# EAGLE design EPWR01 (EAGLE 7.2.0)
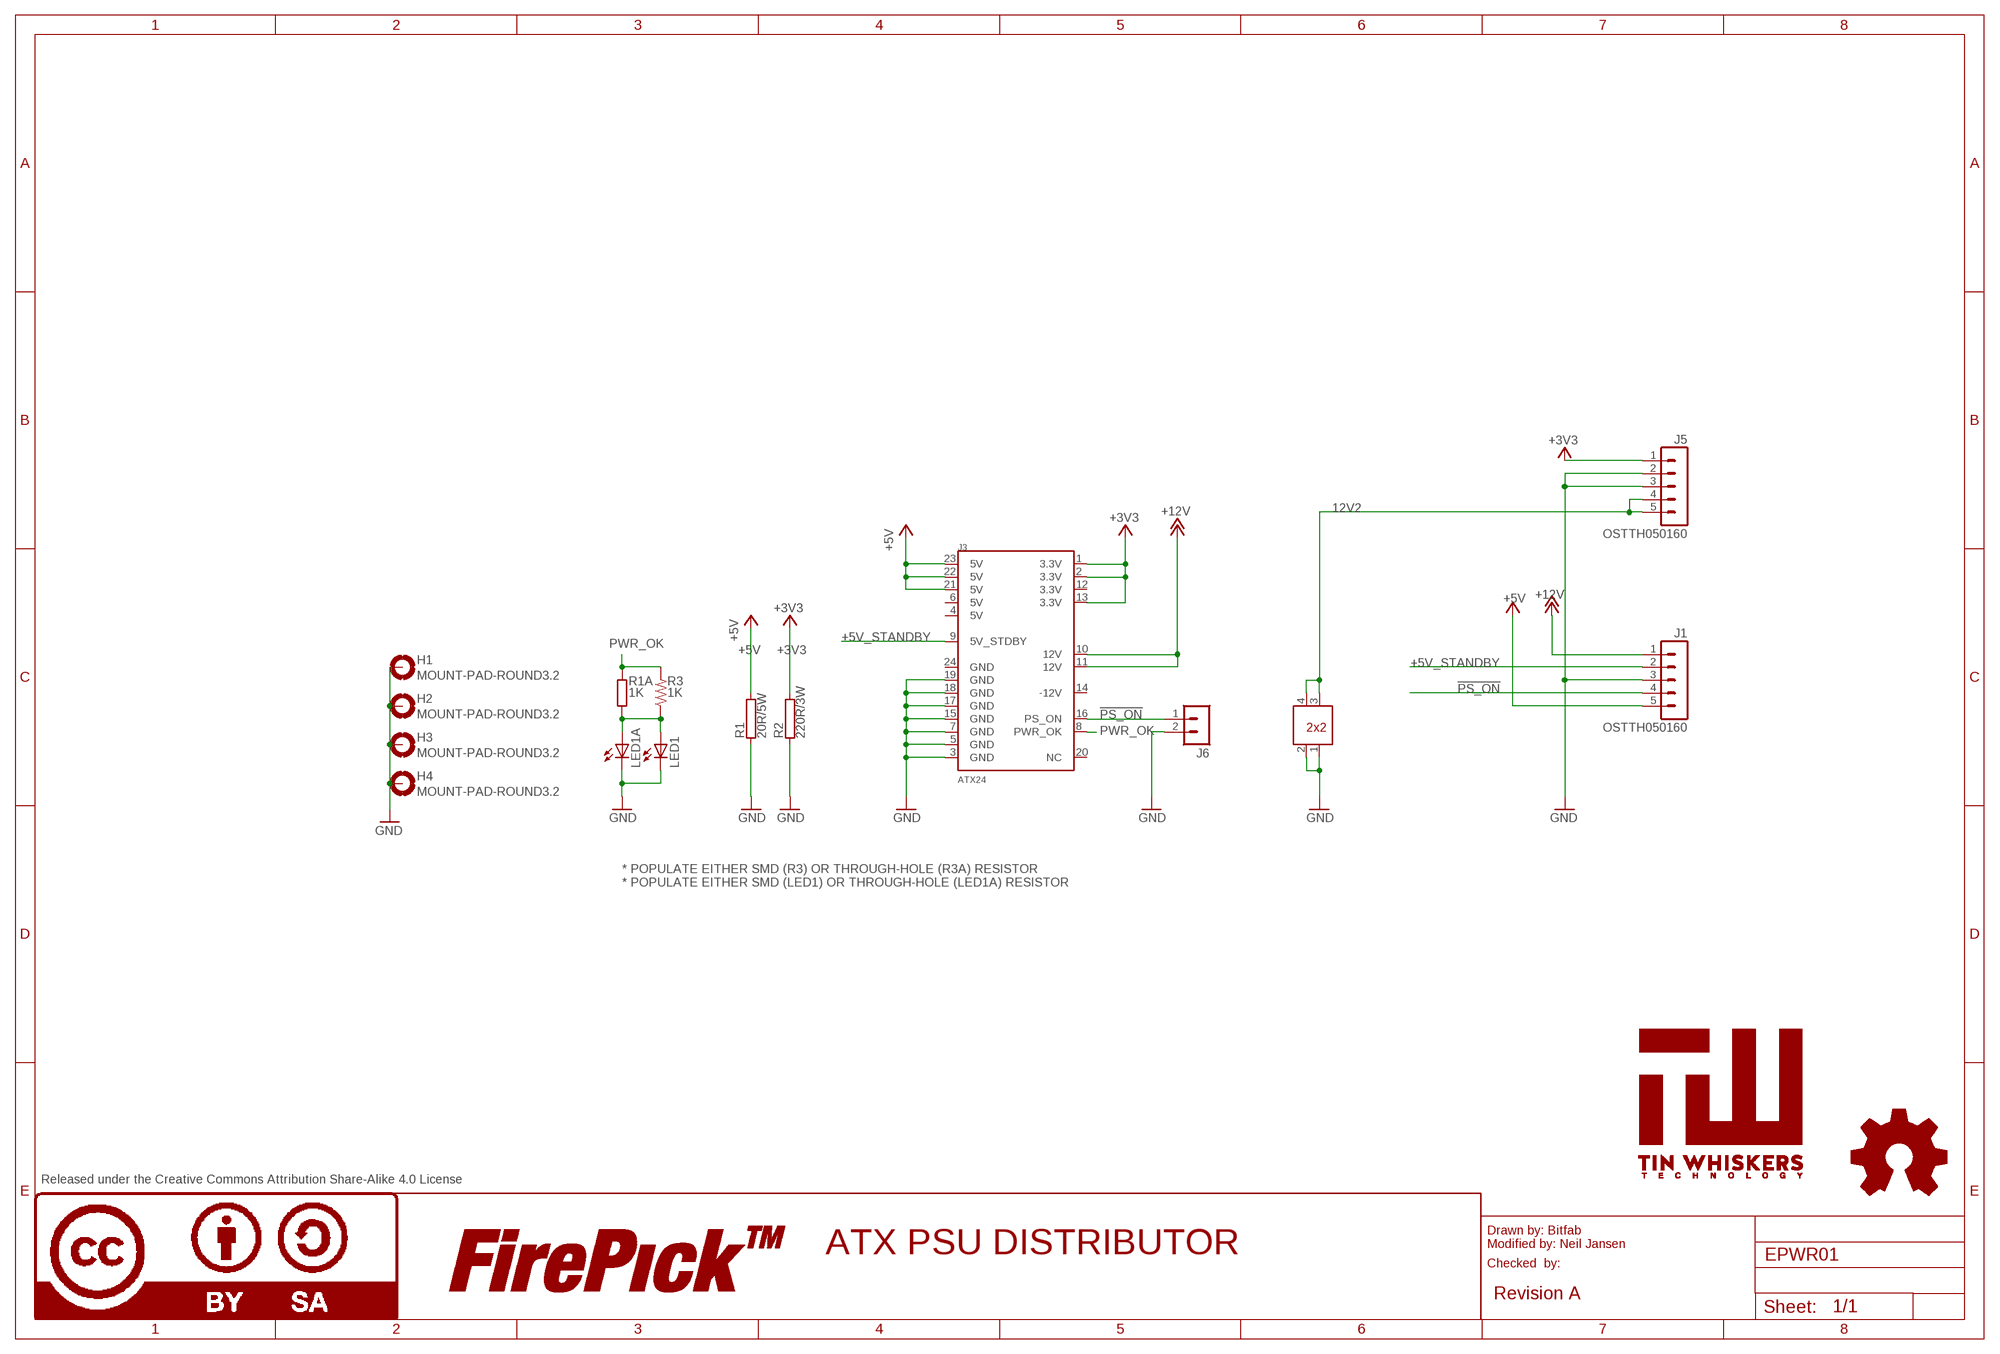
[diagram p0: schematic, sheet 1]

## Parts
H1  MOUNT-PAD-ROUND3.2  [3,2-PAD]
H2  MOUNT-PAD-ROUND3.2  [3,2-PAD]
H3  MOUNT-PAD-ROUND3.2  [3,2-PAD]
H4  MOUNT-PAD-ROUND3.2  [3,2-PAD]
J1  OSTTH050160  CONN-OSTTH050160  [CONN-OSTTH050160]
J3  ATX24  ATX24-REVERSIBLE  [ATX24]
J4  ATX2X2  [ATX2X2]
J5  OSTTH050160  CONN-OSTTH050160  [CONN-OSTTH050160]
J6  MA02-1  [MA02-1]
LED1  LED1206  [LED-1206]
LED1A  LED3MM  [LED3MM]
LOGO4  LOGO-FIREPICKLARGE  [LOGO-FIREPICK]
LOGO5  LOGO-OSHWMEDIUM  [LOGO-OSHW-MEDIUM]
LOGO6  LOGO-CC-BY-SALARGE  [LOGO-CC-BY-SA]
R1  20R/5W  RHPS923  [HPS923]
R1A  1K  R-EU_0207/10  [0207/10]
R2  220R/3W  RCA4050  [CA4050]
R3  1K  RESISTOR0805-RES  [0805]
U$1  TIN-WHISKERSSMALL  [TIN-WHISKERS-SMALL]

## Nets
12V2: J4.3 J4.4 J5.4 J5.5
!PS_ON: J1.4 J3.16(PS_ON) J6.1
+3V3: J3.1(3.3V) J3.2(3.3V) J3.13(3.3V) J5.1 R2.2
+5V: J1.5 J3.21(5V) J3.22(5V) J3.23(5V) R1.2
+5V_STANDBY: J1.2 J3.9(5V_STDBY)
+12V: J1.1 J3.10(12V) J3.11(12V)
GND: H1.B3,2(MOUNT) H2.B3,2(MOUNT) H3.B3,2(MOUNT) H4.B3,2(MOUNT) J1.3 J3.3(GND) J3.5(GND) J3.7(GND) J3.15(GND) J3.17(GND) J3.18(GND) J3.19(GND) J4.1 J4.2 J5.2 J5.3 J6.2 LED1.C LED1A.K(C) R1.1 R2.1
N$2: LED1.A LED1A.A R1A.1 R3.1
PWR_OK: J3.8(PWR_OK) R1A.2 R3.2
Unconnected: J3.4(5V) J3.6(5V) J3.12(3.3V) J3.14(-12V) J3.20(NC) J3.24(GND)

## Notes on the sheet
- * POPULATE EITHER SMD (R3) OR THROUGH-HOLE (R3A) RESISTOR
  * POPULATE EITHER SMD (LED1) OR THROUGH-HOLE (LED1A) RESISTOR
- Released under the Creative Commons Attribution Share-Alike 4.0 License
- Drawn by: Bitfab
  Modified by: Neil Jansen
- Checked  by:
- ATX PSU DISTRIBUTOR
- Revision A

## Library data of the parts
H1-H4 = holes:MOUNT-PAD-ROUND: MOUNTING PAD, round; BOM: EXCLUDE
J1 J5 = FirePick:CONN-OSTTH050160; PARTNO: OSTTH050160
J3 = SparkFun:ATX24-REVERSIBLE; PARTNO: 2-1586043-4
J4 = SparkFun:ATX2X2; PARTNO: 1586041-4
J6 = !con-lstb:MA02-1; PARTNO: CONN-0.1-RA-1X2
LED1 = SparkFun-LED:LED: LEDs Standard schematic elements and footprints for 5mm, 3mm, 1206, and 0603 sized LEDs. 5mm - Spark Fun Electronics SKU : COM-00529 (and others); PARTNO: LTST-C150AKT
LED1A = led:LED: LED OSRAM: - CHIPLED LG R971, LG N971, LY N971, LG Q971, LY Q971, LO R971, LY R971 LH N974, LH R974 LS Q976, LO Q976, LY Q976 LO Q996 - Hyper CHIPLED LW Q18S LB Q993, LB Q99A, LB R99A - SideLED LS A670, LO A670, LY A670, LG A670, LP A670 LB A673, LV A673, LT A673, LW A673 LH A674 LY A675 LS A676, LA A676, LO A676, LY A676, LW A676 LS A679, LY A679, LG A679 - Hyper Micro SIDELED® LS Y876, LA Y876, LO Y876, LY Y876 LT Y87S - SmartLED LW L88C, LW L88S LB L89C, LB L89S, LG L890 LS L89K, LO L89K, LY L89K LS L896, LA L896, LO L896, LY L896 - TOPLED LS T670, LO T670, LY T670, LG T670, LP T670 LSG T670, LSP T670, LSY T670, LOP T670, LYG T670 LG T671, LOG T671, LSG T671 LB T673, LV T673, LT T673, LW T673 LH T674 LS T676, LA T676, LO T676, LY T676, LB T676, LH T676, LSB T676, LW T676 LB T67C, LV T67C, LT T67C, LS T67K, LO T67K, LY T67K, LW E67C LS E67B, LA E67B, LO E67B, LY E67B, LB E67C, LV E67C, LT E67C LW T67C LS T679, LY T679, LG T679 LS T770, LO T770, LY T770, LG T770, LP T770 LB T773, LV T773, LT T773, LW T773 LH T774 LS E675, LA E675, LY E675, LS T675 LS T776, LA T776, LO T776, LY T776, LB T776 LHGB T686 LT T68C, LB T68C - Hyper Mini TOPLED® LB M676 - Mini TOPLED Santana® LG M470 LS M47K, LO M47K, LY M47K Source: http://www.osram.convergy.de LUXEON: - LUMILED® LXK2-PW12-R00, LXK2-PW12-S00, LXK2-PW14-U00, LXK2-PW14-V00 LXK2-PM12-R00, LXK2-PM12-S00, LXK2-PM14-U00 LXK2-PE12-Q00, LXK2-PE12-R00, LXK2-PE12-S00, LXK2-PE14-T00, LXK2-PE14-U00 LXK2-PB12-K00, LXK2-PB12-L00, LXK2-PB12-M00, LXK2-PB14-N00, LXK2-PB14-P00, LXK2-PB14-Q00 LXK2-PR12-L00, LXK2-PR12-M00, LXK2-PR14-Q00, LXK2-PR14-R00 LXK2-PD12-Q00, LXK2-PD12-R00, LXK2-PD12-S00 LXK2-PH12-R00, LXK2-PH12-S00 LXK2-PL12-P00, LXK2-PL12-Q00, LXK2-PL12-R00 Source: www.luxeon.com KINGBRIGHT: KA-3528ASYC Source: www.kingbright.com; DNP: T; PARTNO: *
LOGO4 = FirePick:LOGO-FIREPICK; BOM: EXCLUDE
LOGO5 = FirePick:LOGO-OSHW; BOM: EXCLUDE
LOGO6 = FirePick:LOGO-CC-BY-SA; BOM: EXCLUDE
R1 = resistor-power:R: Power Resitor; OC_FARNELL: unknown; OC_NEWARK: unknown; PARTNO: SQP500JB-20R
R1A = resistor:R-EU_: RESISTOR, European symbol; DNP: T
R2 = resistor-power:R: Power Resitor; OC_FARNELL: unknown; OC_NEWARK: unknown; PARTNO: PNP3WVJR-73-220R
R3 = SparkFun-Resistors:RESISTOR: Resistor Basic schematic elements and footprints for 0603, 1206, and PTH resistors.; PARTNO: RC0805FR-071KL
U$1 = !tin-whiskers:TIN-WHISKERS

## Net classes
0 default: width 0.152 mm, drill 0.305 mm, clearance 0.152 mm

## Board
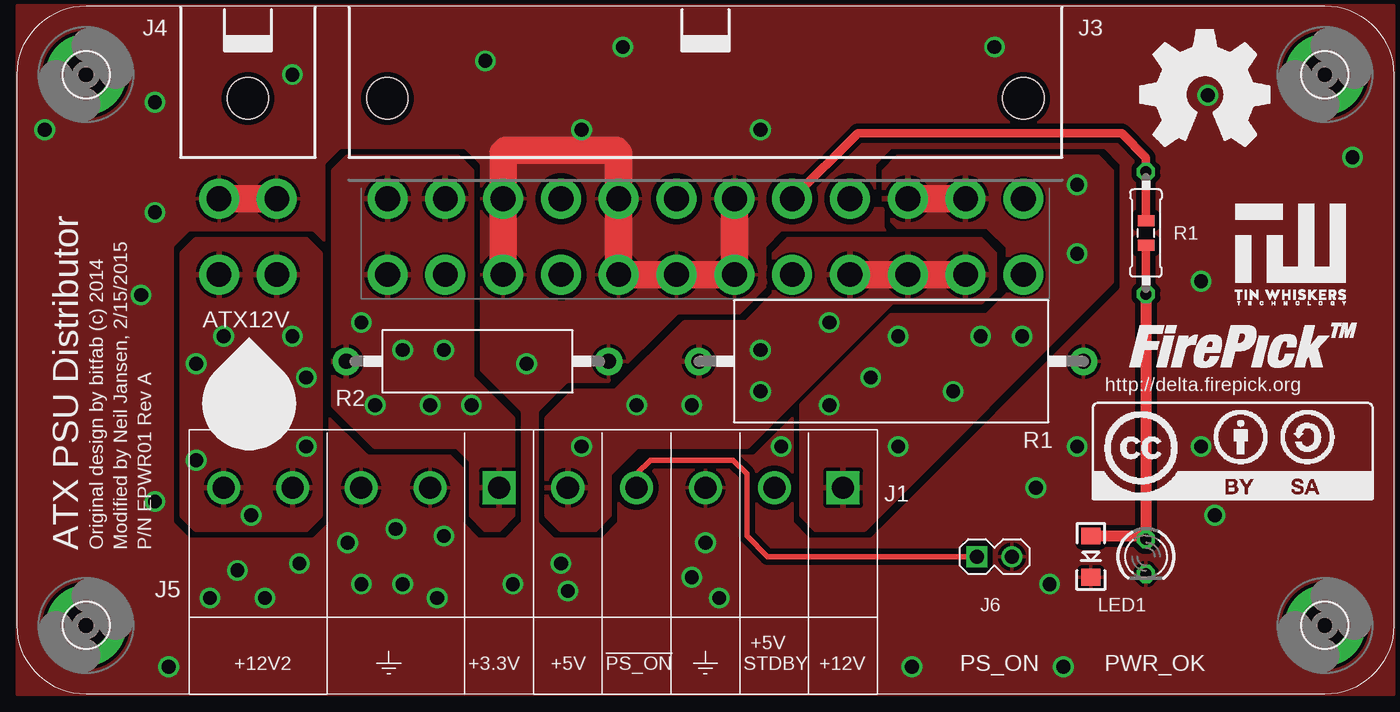
[diagram p1: board, top side]
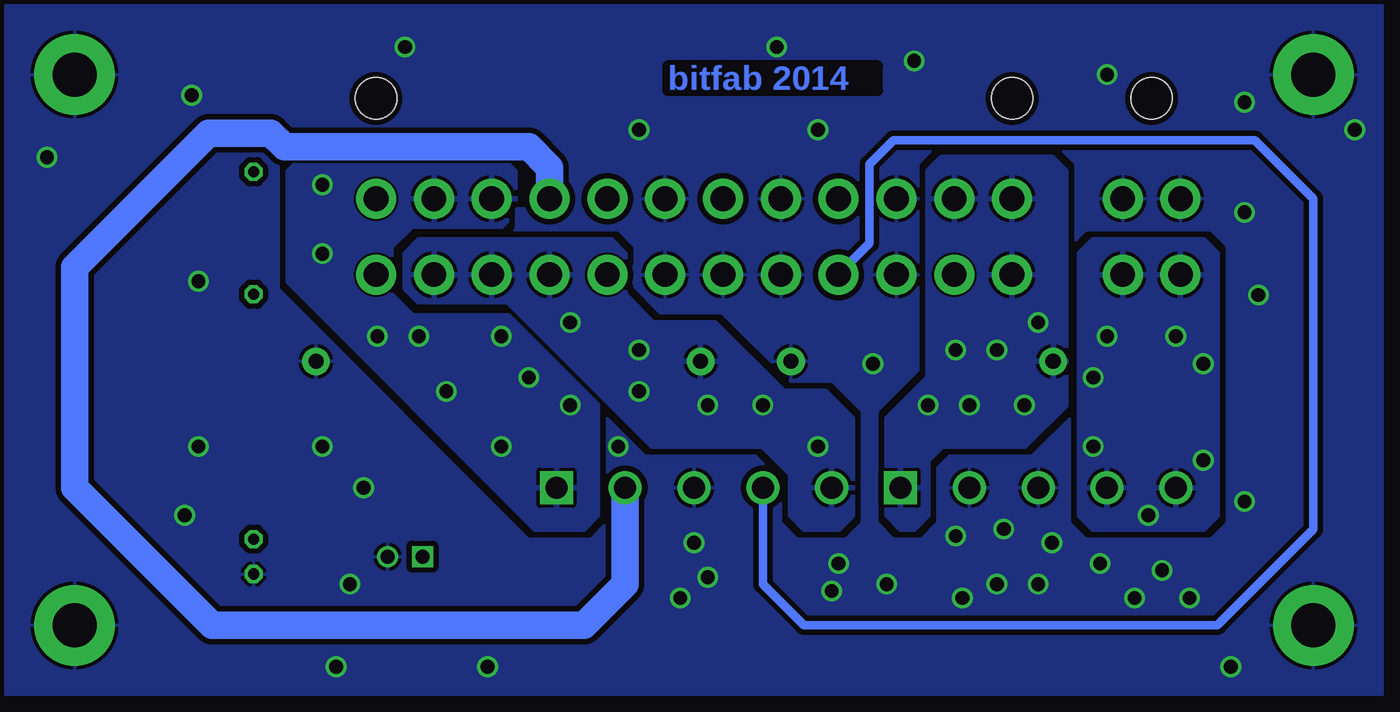
[diagram p2: board, bottom side, seen from below]

No outline drawn. Coordinates in mm, seen from the top.
Copper layers (1*16): Top 0.035mm / dielectric 1.5mm / Bottom 0.035mm
Design rules "SeeedStudio_2layer_DRU_no_angle_20140221": minimum track width 6mil, minimum drill 12mil, track to track 6mil, track to pad 6mil, pad to pad 6mil, via to via 6mil, smd to smd 0mil, copper to edge 10mil, drill to drill 10mil, minimum pad ring 10mil, minimum via ring 6mil, stop-mask expansion 2mil, vias tented up to drill 100mil, thermal gap 10mil

### Footprints (pad centres in the part's own frame; a part is rotated, then mirrored left to right if it is on the bottom)
3,2-PAD = drill 3.2 pad 5.842: B3,2 0,0
CONN-OSTTH050160 = drill 1.6 square: 1 -10,0 | drill 1.6: 2 -5,0; 3 0,0; 4 5,0; 5 10,0
ATX24 = drill 1.8 pad 2.9: 1 23.1,6.03; 2 18.9,6.03; 3 14.7,6.03; 4 10.5,6.03; 5 6.3,6.03; 6 2.1,6.03; 7 -2.1,6.03; 8 -6.3,6.03; 9 -10.5,6.03; 10 -14.7,6.03; 11 -18.9,6.03; 12 -23.1,6.03; 13 23.1,11.53; 14 18.9,11.53; 15 14.7,11.53; 16 10.5,11.53; 17 6.3,11.53; 18 2.1,11.53; 19 -2.1,11.53; 20 -6.3,11.53; 21 -10.5,11.53; 22 -14.7,11.53; 23 -18.9,11.53; 24 -23.1,11.53 | hole 3: -23.1,-1.27; 23.1,-1.27
ATX2X2 = drill 1.8 pad 2.9: 1 2.1,6.03; 2 -2.1,6.03; 3 2.1,11.53; 4 -2.1,11.53 | hole 3: 0,-1.27
MA02-1 = drill 1.016 square: 1 -1.27,0 | drill 1.016: 2 1.27,0
LED-1206 = smd 1.2 x 1.4: A -1.5,0; C 1.5,0
LED3MM = drill 0.813 octagon: A -1.27,0; K 1.27,0
HPS923 = drill 1.1 pad 2: 1 -13.97,0; 2 13.97,0
0207/10 = drill 0.813 octagon: 1 -4.445,0; 2 4.445,0
CA4050 = drill 1.1 pad 2: 1 -9.525,0; 2 9.525,0
0805 = smd 0.8 x 1.2: 1 -0.9,0; 2 0.9,0

### Placement (x,y rotation side)
H1  5,45 0 top
H2  95,45 0 top
H3  95,5 0 top
H4  5,5 0 top
J1  50,15 180 top
J3  50,42.01 180 top
J4  16.76,42.01 180 top
J5  25,15 180 top
J6  71,10 0 top
LED1  78,10 270 top
LED1A  82,10 270 top
LOGO4  80.6,22 0 top
LOGO5  86.3,43.6 0 top
LOGO6  78.1,14.1 0 top
R1  63.49,24.18 180 top
R1A  82,33.5 90 top
R2  33.44,24.18 180 top
R3  82,33.5 90 top
U$1  88,28 0 top
U$5  [REPRAP_BSTOP]  64.06,42.71 0 top
U$6  [OSHS_10X200_BSTOP]  57.59,43.09 0 top

### Tracks (layer width: path | path; a pad name or v marks a point on that pad's centre or on a via)
12V2  (via drill 1)
  other vias: 15,26 13,24 13,17 17,13 21,18 21,23 20,26
  pour Bottom: 22,13 21,12 13,12 12,13 12,32 13,33 21,33 22,32
  pour Top: 13,33 12,32 12,13 13,12 21,12 22,13 22,32 21,33
!PS_ON
  Top 0.4: J6.1 54.5,10 53,11.5 53,16 52,17 46,17 45,16 J1.4
  Bottom 0.4: J3.16 39.5,30.5
  Bottom 0.6: 39.5,30.5 37.25,32.75 37.25,38.5 35.5,40.25 9.25,40.25 5,36 5,12 12,5 42,5 45,8 J1.4
+3V3  (via drill 1)
  other vias: 31,25 30,21 33,21 26,21 25,27 28,25
  pour Bottom: 33,13 34,12 35,12 36,13 36,20 33,23 33,38 32,39 24,39 23,38 23,21 26,18 32,18 33,17
  pour Top: 24,39 23,38 23,21 26,18 32,18 33,17 33,13 34,12 35,12 36,13 36,20 33,23 33,38 32,39
+5V  (via drill 1)
  Top 2: J3.23 J3.22 J3.21
  other vias: 54,25 54,22 59,27 49,21 45,21 41,18
  pour Bottom: 39.5,12 42,12 43,13 43,16 45,18 53,18 63.5,28.5 70,28.5 71,29.5 71,32 70,33 56,33 55,32 55,29 53,27 48.5,27 43.5,22 40.5,22 38.5,20 38.5,13
  pour Top: 38.5,13 39.5,12 42,12 43,13 43,16 45,18 53,18 63.5,28.5 70,28.5 71,29.5 71,32 70,33 56,33 55,32 55,29 53,27 48.5,27 43.5,22 40.5,22 38.5,20
+5V_STANDBY
  Bottom 2: J3.9 60.5,38.25 62,39.75 79.75,39.75 80.75,40.75 85.25,40.75 95,31 95,15 85,5 58,5 55,8 J1.2
+12V  (via drill 1)
  Top 2: J3.11 J3.10
  other vias: 59,21 62,23 64,26 70,26 73,26 68,22 64,18 77,32 77,37
  pour Bottom: 57,21 57,13 58,12 61.5,12 79.5,30 79.5,38 78.5,39 64,39 63,38 63,35 64,34 70.5,34 72,32.5 72,29 70.5,27.5 63.5,27.5
  pour Top: 57,13 58,12 61.5,12 79.5,30 79.5,38 78.5,39 64,39 63,38 63,35 64,34 70.5,34 72,32.5 72,29 70.5,27.5 63.5,27.5 57,21
GND  (via drill 1)
  Top 2: J3.7 J3.19 J3.18 J3.17 J3.5 43.7,39.3 43.5,39.5 35.5,39.5 35.3,39.3 J3.3 J3.15 | J4.1 J4.2
  other vias: 75,8 74,15 77,18 86,18 87,13 86,30 97,39 51,7 65,2 76,2 36,8 25,8 28,8 16,9 11,2 10,14 9,29 10,35 2,41 10,43 20,45 34,46 41,41 44,47 54,41 71,47 86.5,43.5 37,24 50,11 24,11 27.5,12 31,11.5 30.5,7 20.5,9.5 18,7 14,7 39.5,9.5 40,7.5 49,8.5 55.5,18
  pour Top (isolate 0.406, rank 2): 0,50 100,50 100,0 0,0
  pour Bottom (isolate 0.406, rank 2): 0,50 100,50 100,0 0,0
N$2
  Top 0.6: R3.1 R1A.1
  Top 0.8: R1A.1 LED1A.A 81.77,11.5 LED1.A
PWR_OK
  Top 0.6: J3.8 61.06,40.74 80.23,40.74 82,38.98 R1A.2 R3.2

### Text on the board
Bottom: bitfab 2014
tPlace: R1 | ATX12V | http://delta.firepick.org | ATX PSU Distributor | Original design by bitfab (c) 2014 | Modified by Neil Jansen, 2/15/2015 | P/N EPWR01 Rev A | LED1 | +5V | +12V2 | +3.3V | +5V | !PS_ON | STDBY | +12V | PS_ON | PWR_OK